# EAGLE design ledominoux (EAGLE 5.10)
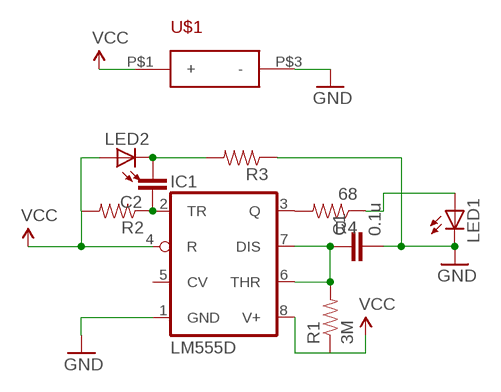
[diagram p0: schematic, sheet 1]

## Parts
C1  0.1u  CAP0805  [0805]
C2  CAP0805  [0805]
IC1  LM555D  [SO08]
LED1  LED0603  [LED-0603]
LED2  LED0603  [LED-0603]
R1  3M  RESISTOR1206  [1206]
R2  RESISTOR1206  [1206]
R3  RESISTOR1206  [1206]
R4  68  RESISTOR1206  [1206]
U$1  DIYBATHOLDER  [DIYBATHOLDER1]

## Nets
GND: C1.2 IC1.1(GND) LED1.C R3.1 U$1.P$3(-)
N$1: C1.1 IC1.6(THR) IC1.7(DIS) R1.2
N$2: C2.1 IC1.2(TR) R2.1
N$3: C2.2 LED2.C R3.2
N$4: IC1.3(Q) R4.2
N$5: LED1.A R4.1
VCC: IC1.4(R) IC1.8(V+) LED2.A R1.1 R2.2 U$1.P$1(+)
Unconnected: IC1.5(CV)

## Library data of the parts
C1 C2 = SparkFun:CAP: Capacitor Standard 0603 ceramic capacitor, and 0.1" leaded capacitor.
IC1 = adafruit:*555: TIMER Changed DIP package to have round (not oval) pin pads http://www.ladyada.net/library/pcb/eaglelibrary.html
LED1 LED2 = SparkFun:LED: LEDs Standard schematic elements and footprints for 5mm, 3mm, 1206, and 0603 sized LEDs. 5mm - Spark Fun Electronics SKU : COM-00529 (and others)
R1-R4 = SparkFun:RESISTOR: Resistor Basic schematic elements and footprints for 0603, 1206, and PTH resistors.
U$1 = dominux:DIYBATHOLDER

## Board
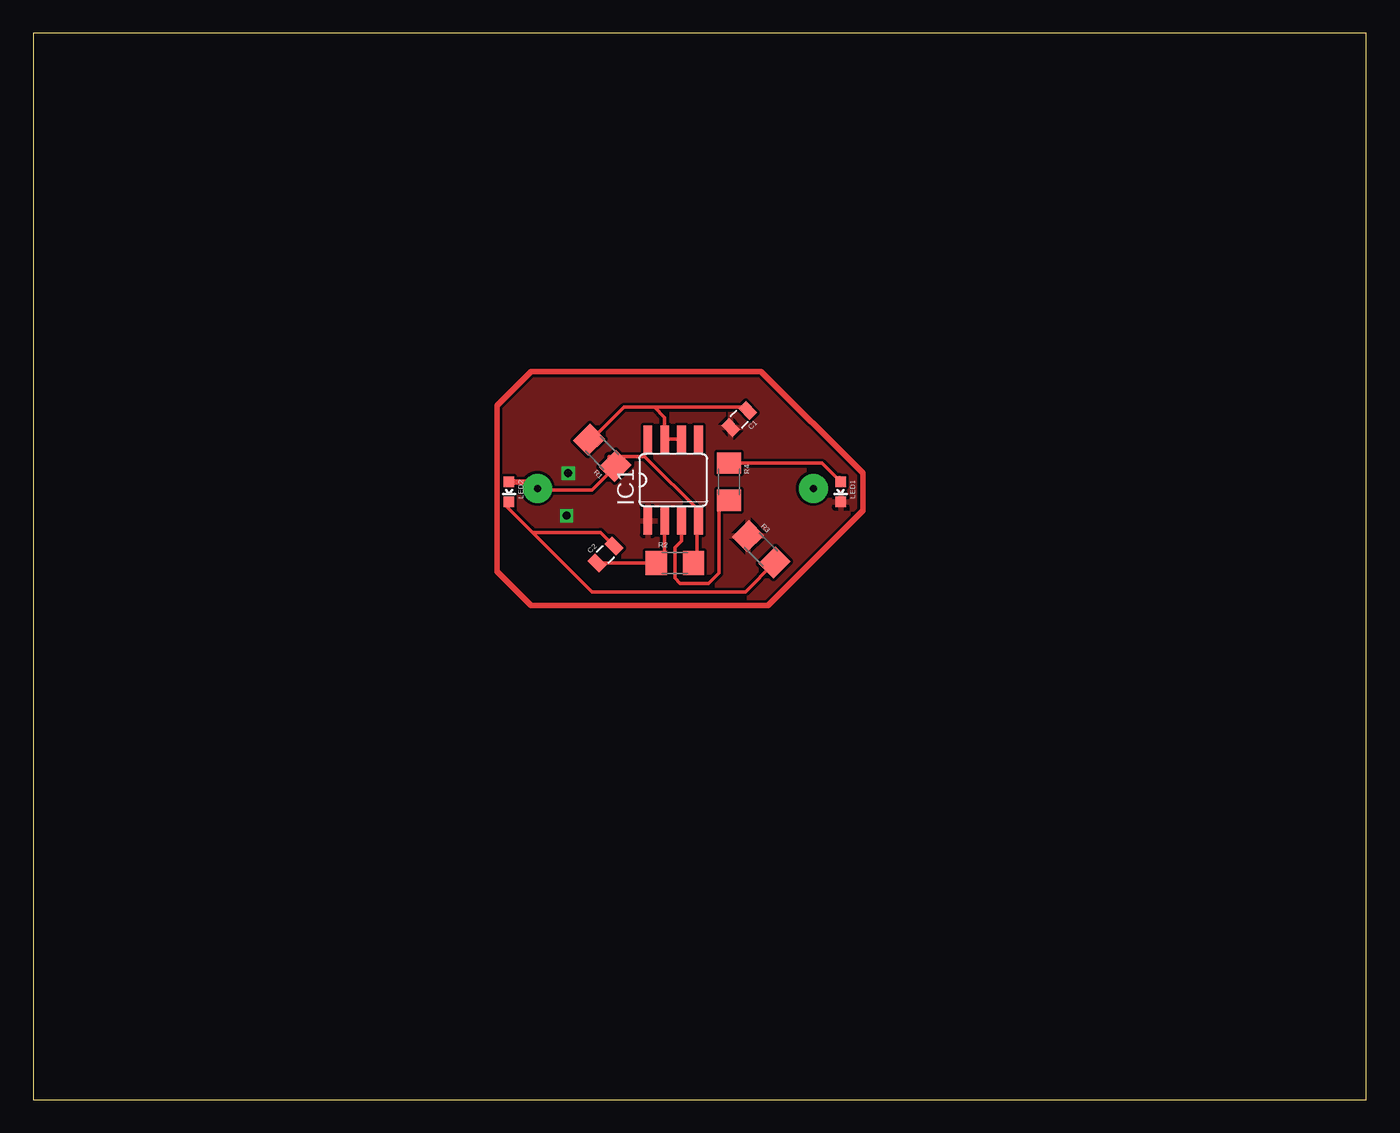
[diagram p1: board, top side]
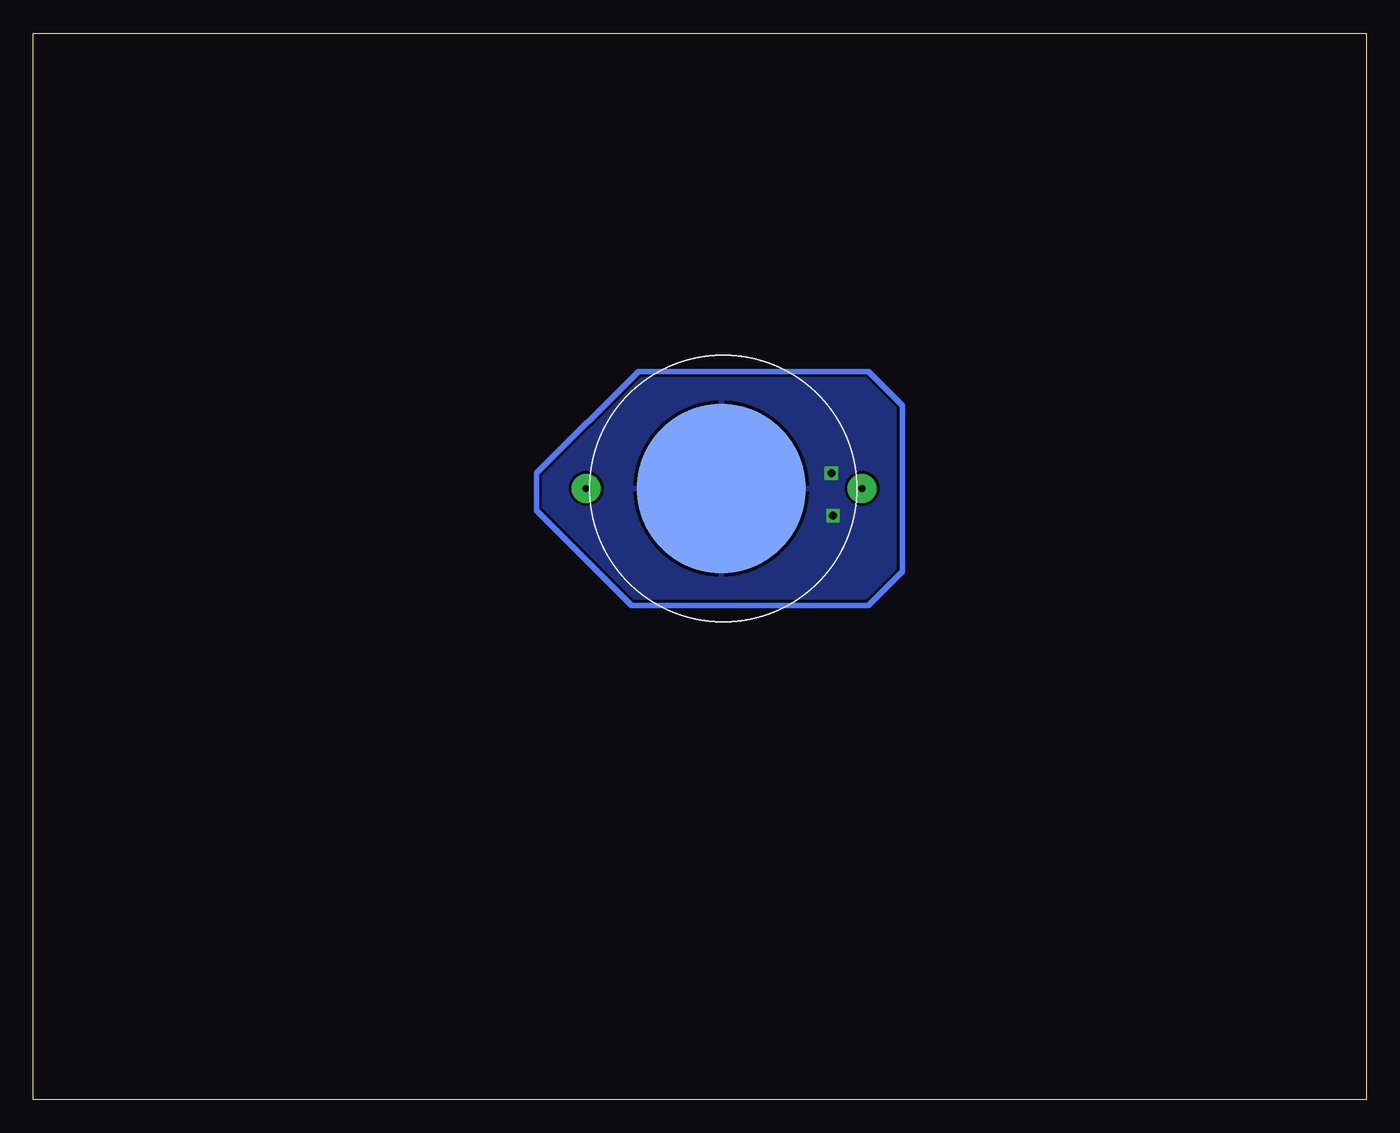
[diagram p2: board, bottom side, seen from below]

Size 100 x 80 mm. Coordinates in mm from the lower left corner, seen from the top.
Outline: 0,0 100,0 100,80 0,80 0,0
Copper layers (1*16): Top 0.035mm / dielectric 1.5mm / Bottom 0.035mm
Design rules "default": minimum track width 10mil, minimum drill 24mil, track to track 8mil, track to pad 8mil, pad to pad 8mil, via to via 8mil, smd to smd 8mil, copper to edge 40mil, drill to drill 8mil, minimum pad ring 10mil, minimum via ring 8mil, stop-mask expansion 4mil, vias tented up to drill 0mil, thermal gap 10mil

### Footprints (pad centres in the part's own frame; a part is rotated, then mirrored left to right if it is on the bottom)
0805 = smd 0.8 x 1.2: 1 -0.9,0; 2 0.9,0
SO08 = smd 0.66 x 2.032: 1 -1.905,-3.073; 2 -0.635,-3.073; 3 0.635,-3.073; 4 1.905,-3.073; 5 1.905,3.073; 6 0.635,3.073; 7 -0.635,3.073; 8 -1.905,3.073
LED-0603 = smd 0.8 x 0.8: A 0,-0.75; C 0,0.75
1206 = smd 1.6 x 1.8: 1 -1.4,0; 2 1.4,0
DIYBATHOLDER1 = drill 0.5 pad 2.184 round: P$1 -0.4,0; P$2 20.3,0 | smd 12.7 x 12.7: P$3 10.16,0

### Placement (x,y rotation side)
C1  52.96,51.05 225 top
C2  42.93,40.89 45 top
IC1  48.01,46.48 0 top
LED1  60.58,45.59 180 top
LED2  35.69,45.59 180 top
R1  42.67,48.51 135 top
R2  48.13,40.26 0 top
R3  54.61,41.27 315 top
R4  52.2,46.35 270 top
U$1  38.23,45.85 180 bottom

### Tracks (layer width: path | path; a pad name or v marks a point on that pad's centre or on a via)
GND  (via drill 0.6)
  Top 0.406: IC1.1 46.1,43.31
  other vias: 40.01,43.81 40.13,46.99
  pour Top: 34.04,56.39 63.25,56.39 63.25,34.92 33.27,34.92 33.27,56.39
  pour Bottom: 33.27,34.92 63.25,34.92 63.25,35.81 63.25,56.39 33.27,56.39 33.27,55.37
N$1
  Top 0.254: R1.2 41.88,49.5 44.32,51.94 46.61,51.94 | 46.61,51.94 53.34,51.94 C1.1 | IC1.6 IC1.7 47.37,51.18 46.61,51.94
N$2
  Top 0.254: 46.1,40.13 46.61,40.13 47.37,40.89 IC1.2 47.37,40.9 R2.1 C2.1
N$3
  Top 0.254: LED2.C 35.56,44.45 37.27,42.74 37.47,42.55 | 37.47,42.55 41.91,38.1 53.41,38.1 R3.2 | C2.2 42.55,42.55 37.47,42.55
N$4
  Top 0.254: IC1.3 48.64,41.91 48.13,41.4 48.13,39.12 48.51,38.73 50.67,38.73 51.44,39.5 51.44,44.19 R4.2
N$5
  Top 0.254: R4.1 59.17,47.76 LED1.A
  Top 0.406: LED1.A 60.46,46.6
N$6
  Top 0.406: 54.61,54.61 62.23,46.99 62.23,44.2 55.12,37.08 37.34,37.08 34.8,39.62 34.8,52.07 37.34,54.61 54.61,54.61
N$8
  Bottom 0.406: 54.61,54.61 62.23,46.99 62.23,44.2 55.12,37.08 37.34,37.08 34.8,39.62 34.8,52.07 37.34,54.61 54.61,54.61
VCC
  Top 0.254: 45.72,48.26 43.18,48.26 43.18,46.99 | 49.53,40.64 R2.2 49.78,40.51 49.78,42.67 50.04,42.93 50.04,43.28 | 43.18,46.99 41.91,45.72 38.1,45.72 U$1.P$1 | 43.18,46.99 R1.1 | 49.91,43.56 IC1.4 50.04,43.28 | 45.72,48.26 46.23,48.77 46.23,49.43 IC1.8 | 45.72,48.26 45.85,48.26 50.04,44.07 50.04,43.28
  Top 0.406: LED2.A 37.33,46.34 U$1.P$1